# Altium schematic sheet 01-POWER.SchDoc
size A3
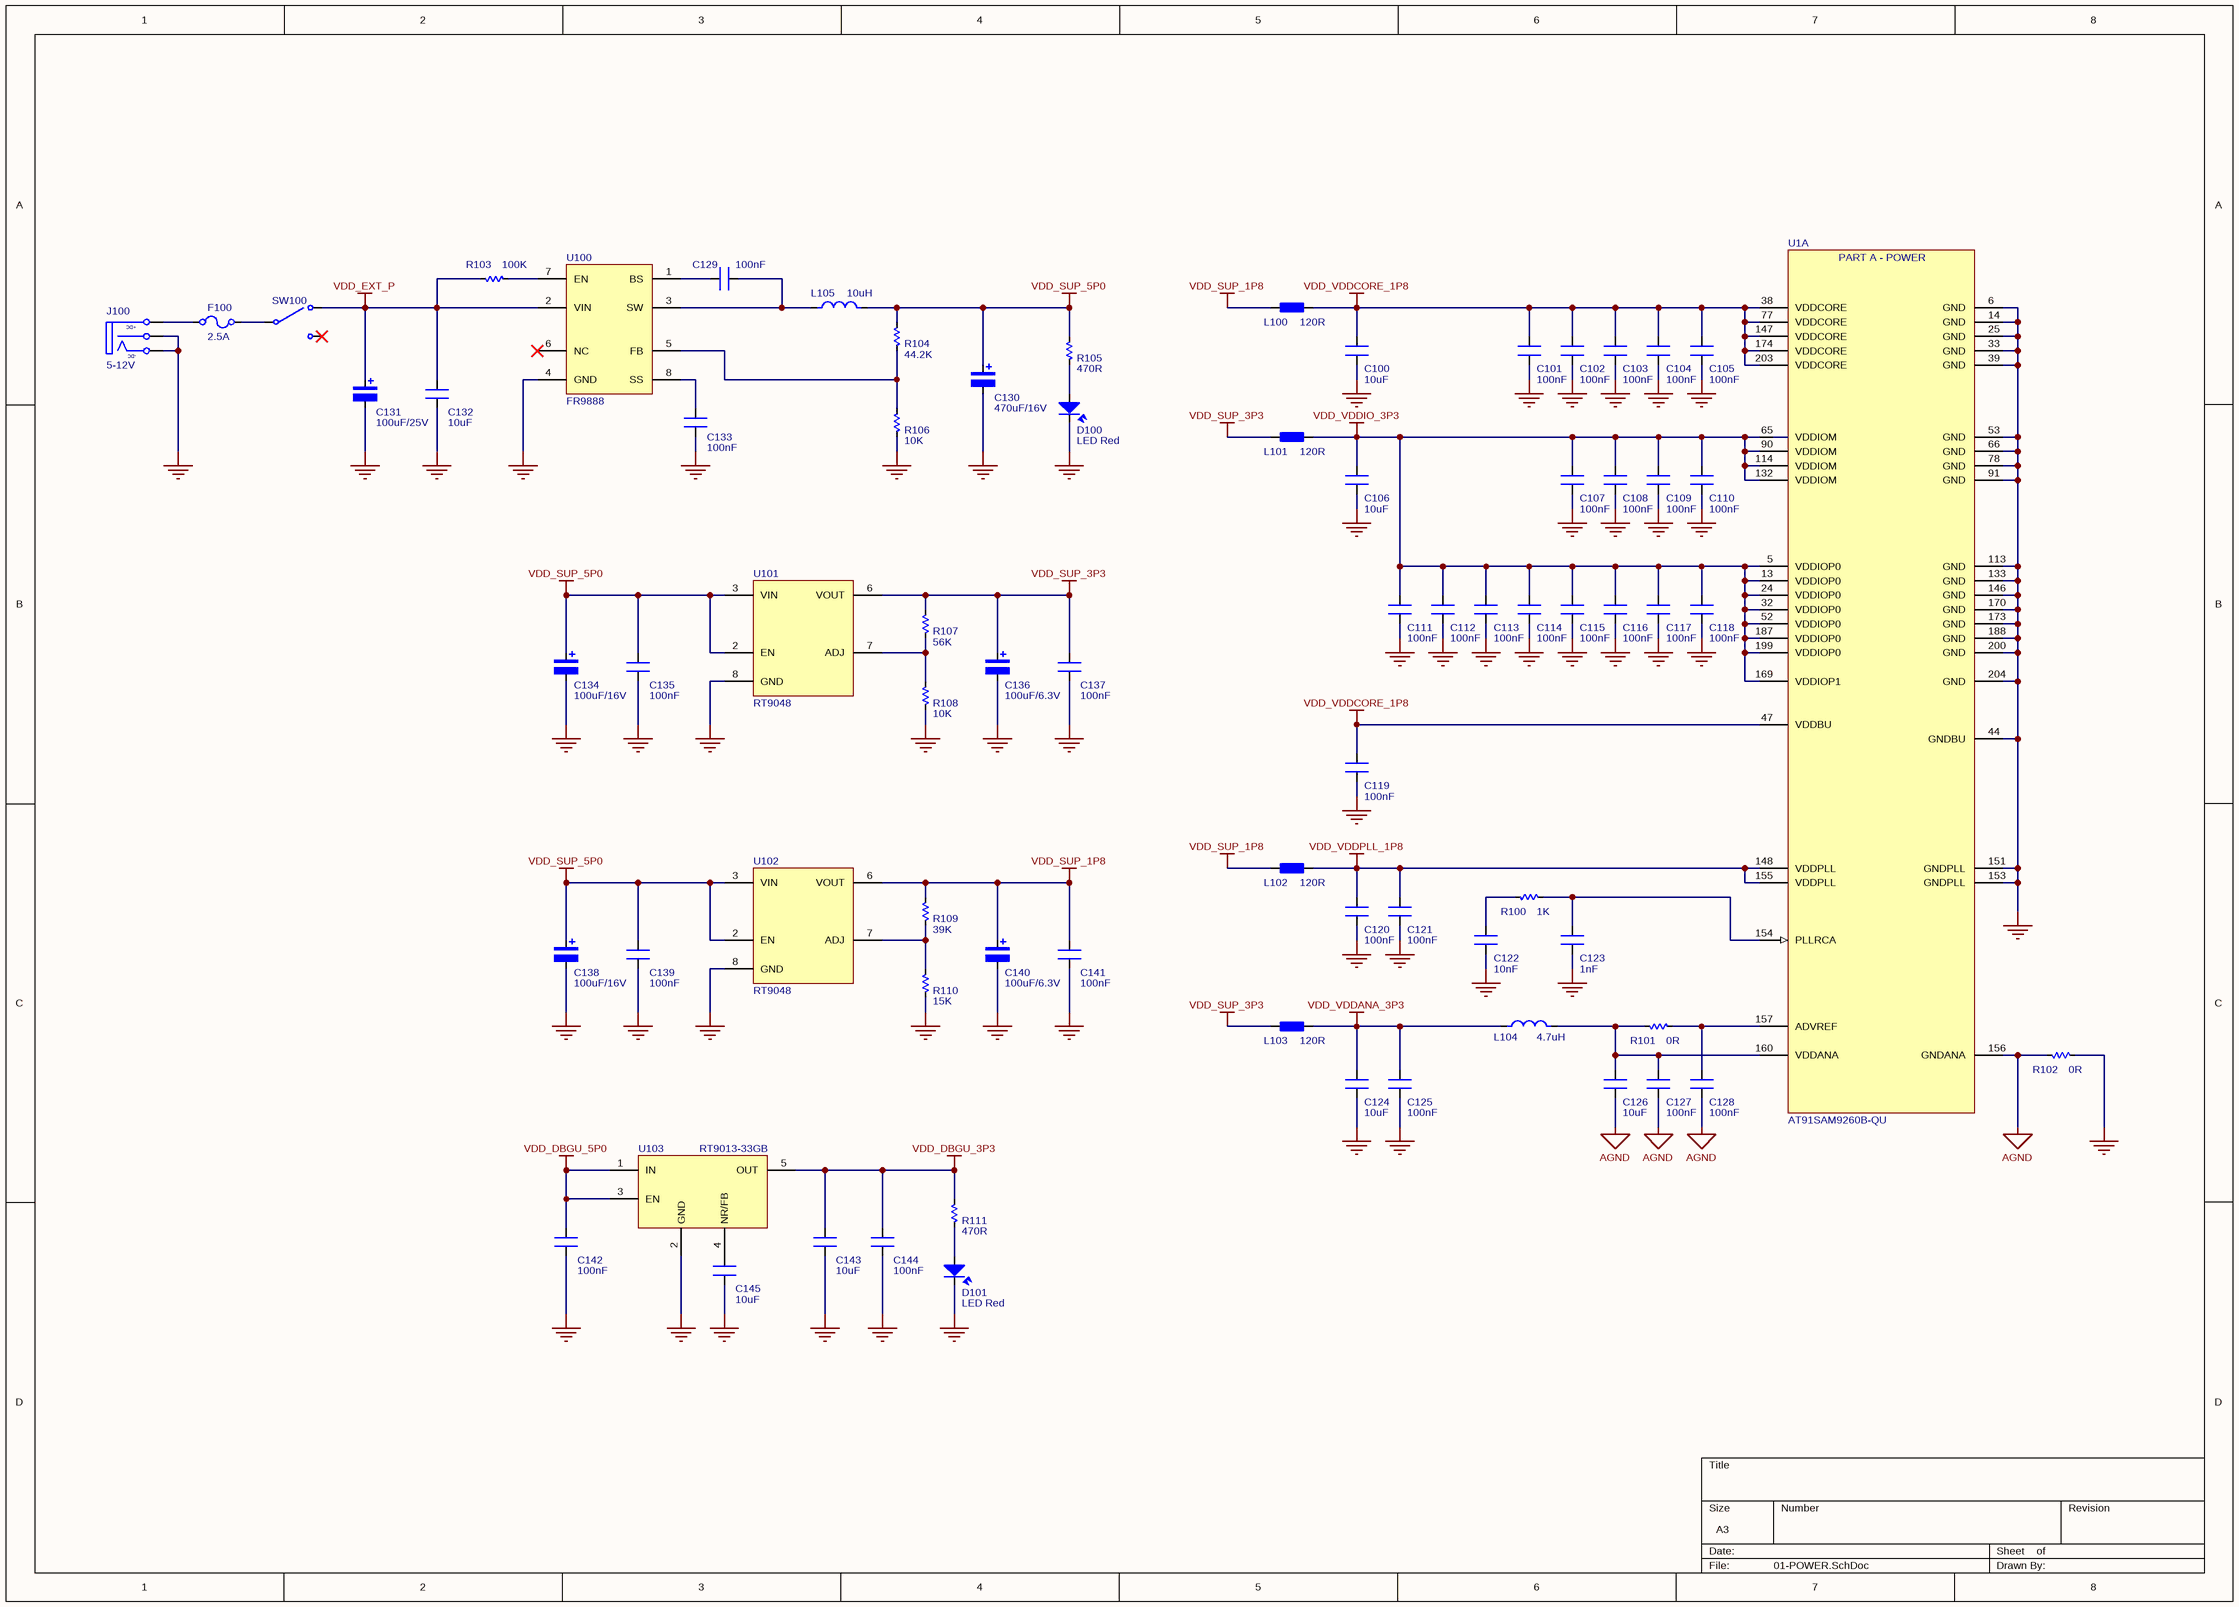
[diagram p0: 01-POWER.SchDoc]

## Parts
C100  value 10uF  [CN-SMD-0603]  (hidden comment: Capacitor)
C101  value 100nF  [CN-SMD-0603]  (hidden comment: Capacitor)
C102  value 100nF  [CN-SMD-0603]  (hidden comment: Capacitor)
C103  value 100nF  [CN-SMD-0603]  (hidden comment: Capacitor)
C104  value 100nF  [CN-SMD-0603]  (hidden comment: Capacitor)
C105  value 100nF  [CN-SMD-0603]  (hidden comment: Capacitor)
C106  value 10uF  [CN-SMD-0603]  (hidden comment: Capacitor)
C107  value 100nF  [CN-SMD-0603]  (hidden comment: Capacitor)
C108  value 100nF  [CN-SMD-0603]  (hidden comment: Capacitor)
C109  value 100nF  [CN-SMD-0603]  (hidden comment: Capacitor)
C110  value 100nF  [CN-SMD-0603]  (hidden comment: Capacitor)
C111  value 100nF  [CN-SMD-0603]  (hidden comment: Capacitor)
C112  value 100nF  [CN-SMD-0603]  (hidden comment: Capacitor)
C113  value 100nF  [CN-SMD-0603]  (hidden comment: Capacitor)
C114  value 100nF  [CN-SMD-0603]  (hidden comment: Capacitor)
C115  value 100nF  [CN-SMD-0603]  (hidden comment: Capacitor)
C116  value 100nF  [CN-SMD-0603]  (hidden comment: Capacitor)
C117  value 100nF  [CN-SMD-0603]  (hidden comment: Capacitor)
C118  value 100nF  [CN-SMD-0603]  (hidden comment: Capacitor)
C119  value 100nF  [CN-SMD-0603]  (hidden comment: Capacitor)
C120  value 100nF  [CN-SMD-0603]  (hidden comment: Capacitor)
C121  value 100nF  [CN-SMD-0603]  (hidden comment: Capacitor)
C122  value 10nF  [CN-SMD-0603]  (hidden comment: Capacitor)
C123  value 1nF  [CN-SMD-0603]  (hidden comment: Capacitor)
C124  value 10uF  [CN-SMD-0603]  (hidden comment: Capacitor)
C125  value 100nF  [CN-SMD-0603]  (hidden comment: Capacitor)
C126  value 10uF  [CN-SMD-0603]  (hidden comment: Capacitor)
C127  value 100nF  [CN-SMD-0603]  (hidden comment: Capacitor)
C128  value 100nF  [CN-SMD-0603]  (hidden comment: Capacitor)
C129  value 100nF  [CN-SMD-0603]  (hidden comment: Capacitor)
C130  value 470uF/16V  [C-ALU-SMD-D6.3W6.6L7.7]  (hidden comment: Cap_Aluminum)
C131  value 100uF/25V  [C-ALU-SMD-D6.3W6.6L7.7]  (hidden comment: Cap_Aluminum)
C132  value 10uF  [CN-SMD-0603]  (hidden comment: Capacitor)
C133  value 100nF  [CN-SMD-0603]  (hidden comment: Capacitor)
C134  value 100uF/16V  [C-TAL-SMD-7343-31]  (hidden comment: Cap_Tantalum)
C135  value 100nF  [CN-SMD-0603]  (hidden comment: Capacitor)
C136  value 100uF/6.3V  [C-TAL-SMD-3216-18]  (hidden comment: Cap_Tantalum)
C137  value 100nF  [CN-SMD-0603]  (hidden comment: Capacitor)
C138  value 100uF/16V  [C-TAL-SMD-7343-31]  (hidden comment: Cap_Tantalum)
C139  value 100nF  [CN-SMD-0603]  (hidden comment: Capacitor)
C140  value 100uF/6.3V  [C-TAL-SMD-3216-18]  (hidden comment: Cap_Tantalum)
C141  value 100nF  [CN-SMD-0603]  (hidden comment: Capacitor)
C142  value 100nF  [CN-SMD-0603]  (hidden comment: Capacitor)
C143  value 10uF  [CN-SMD-0603]  (hidden comment: Capacitor)
C144  value 100nF  [CN-SMD-0603]  (hidden comment: Capacitor)
C145  value 10uF  [CN-SMD-0603]  (hidden comment: Capacitor)
D100  LED Red  [LED-SMD-0805-RED]
D101  LED Red  [LED-SMD-0805-RED]
F100  2.5A  [FUSE-SMD-1812]
J100  5-12V  [JACK-DC_5.5x2.1]
L100  value 120R  [L-SMD-0603]  (hidden comment: Ferrite bead)
L101  value 120R  [L-SMD-0603]  (hidden comment: Ferrite bead)
L102  value 120R  [L-SMD-0603]  (hidden comment: Ferrite bead)
L103  value 120R  [L-SMD-0603]  (hidden comment: Ferrite bead)
L104  value 4.7uH  [L-SMD-0603]  (hidden comment: Inductor)
L105  value 10uH  [L-SMD-0630]  (hidden comment: Inductor)
R100  value 1K  [RES-SMD-0603]  (hidden comment: Resistor)
R101  value 0R  [RES-SMD-0603]  (hidden comment: Resistor)
R102  value 0R  [RES-SMD-0603]  (hidden comment: Resistor)
R103  value 100K  [RES-SMD-0603]  (hidden comment: Resistor)
R104  value 44.2K  [RES-SMD-0603]  (hidden comment: Resistor)
R105  value 470R  [RES-SMD-0603]  (hidden comment: Resistor)
R106  value 10K  [RES-SMD-0603]  (hidden comment: Resistor)
R107  value 56K  [RES-SMD-0603]  (hidden comment: Resistor)
R108  value 10K  [RES-SMD-0603]  (hidden comment: Resistor)
R109  value 39K  [RES-SMD-0603]  (hidden comment: Resistor)
R110  value 15K  [RES-SMD-0603]  (hidden comment: Resistor)
R111  value 470R  [RES-SMD-0603]  (hidden comment: Resistor)
SW100  SW3-SLIDE  [SW3_SS12F23]  (value not drawn)
U1  AT91SAM9260B-QU  [PQFP50P3060X3060X410-208N]  (part A of 6)
U100  FR9888  [SOIC127P600X175_HS-9N]
U101  RT9048  [SOIC127P600X175_HS-9N]
U102  RT9048  [SOIC127P600X175_HS-9N]
U103  RT9013-33GB  [SOT95P245X110-5N]

## Nets
AGND: C126.1 C127.1 C128.1 R102.2 U1.156(GNDANA)
GND: C100.1 C101.1 C102.1 C103.1 C104.1 C105.1 C106.1 C107.1 C108.1 C109.1 C110.1 C111.1 C112.1 C113.1 C114.1 C115.1 C116.1 C117.1 C118.1 C119.1 C120.1 C121.1 C122.1 C123.1 C124.1 C125.1 C130.2 C131.2 C132.1 C133.1 C134.2 C135.1 C136.2 C137.1 C138.2 C139.1 C140.2 C141.1 C142.1 C143.1 C144.1 C145.1 D100.2 D101.2 J100.2(-DC) J100.3 R102.1 R106.2 R108.2 R110.2 U1.6(GND) U1.14(GND) U1.25(GND) U1.33(GND) U1.39(GND) U1.44(GNDBU) U1.53(GND) U1.66(GND) U1.78(GND) U1.91(GND) U1.113(GND) U1.133(GND) U1.146(GND) U1.151(GNDPLL) U1.153(GNDPLL) U1.170(GND) U1.173(GND) U1.188(GND) U1.200(GND) U1.204(GND) U100.4(GND) U101.8(GND) U102.8(GND) U103.2(GND)
VDD_DBGU_3P3: C143.2 C144.2 R111.1 U103.5(OUT)
VDD_DBGU_5P0: C142.2 U103.1(IN) U103.3(EN)
VDD_EXT_P: C131.1 C132.2 R103.2 SW100.1 U100.2(VIN)
VDD_SUP_1P8: C140.1 C141.2 L100.2 L102.2 R109.1 U102.6(VOUT)
VDD_SUP_3P3: C136.1 C137.2 L101.2 L103.2 R107.1 U101.6(VOUT)
VDD_SUP_5P0: C130.1 C134.1 C135.2 C138.1 C139.2 L105.2 R104.1 R105.1 U101.2(EN) U101.3(VIN) U102.2(EN) U102.3(VIN)
VDD_VDDANA_3P3: C124.2 C125.2 L103.1 L104.2
VDD_VDDCORE_1P8: C100.2 C101.2 C102.2 C103.2 C104.2 C105.2 C119.2 L100.1 U1.38(VDDCORE) U1.47(VDDBU) U1.77(VDDCORE) U1.147(VDDCORE) U1.174(VDDCORE) U1.203(VDDCORE)
VDD_VDDIO_3P3: C106.2 C107.2 C108.2 C109.2 C110.2 C111.2 C112.2 C113.2 C114.2 C115.2 C116.2 C117.2 C118.2 L101.1 U1.5(VDDIOP0) U1.13(VDDIOP0) U1.24(VDDIOP0) U1.32(VDDIOP0) U1.52(VDDIOP0) U1.65(VDDIOM) U1.90(VDDIOM) U1.114(VDDIOM) U1.132(VDDIOM) U1.169(VDDIOP1) U1.187(VDDIOP0) U1.199(VDDIOP0)
VDD_VDDPLL_1P8: C120.2 C121.2 L102.1 U1.148(VDDPLL) U1.155(VDDPLL)
NetC122_2: C122.2 R100.2
NetC123_2: C123.2 R100.1 U1.154(PLLRCA)
NetC126_2: C126.2 C127.2 L104.1 R101.2 U1.160(VDDANA)
NetC128_2: C128.2 R101.1 U1.157(ADVREF)
NetC129_1: C129.1 L105.1 U100.3(SW)
NetC129_2: C129.2 U100.1(BS)
NetC133_2: C133.2 U100.8(SS)
NetC145_2: C145.2 U103.4(NR/FB)
NetD100_1: D100.1 R105.2
NetD101_1: D101.1 R111.2
NetF100_1: F100.1 J100.1(+DC)
NetF100_2: F100.2 SW100.2
NetR103_1: R103.1 U100.7(EN)
NetR104_2: R104.2 R106.1 U100.5(FB)
NetR107_2: R107.2 R108.1 U101.7(ADJ)
NetR109_2: R109.2 R110.1 U102.7(ADJ)

Not connected (* = marked no-connect by the designer): SW100 3*; U100 6(NC)*

## Notes on the sheet
- (in symbol AT91SAM9260B-QU, part A) PART A - POWER

## Library data of the parts
C100 C106 C124 C126 = Cap: Ceramic Capacitor SMD 0603 10uF ±20% 10V
C101-C105 C107-C121 C125 C127-C129 C133 = Cap: Ceramic Capacitor SMD 0603 100nF ±20% 10V
C122 = Cap: Ceramic Capacitor SMD 0603 10nF ±20% 10V
C123 = Cap: Ceramic Capacitor SMD 0603 1nF ±20% 10V
C130 = Cap_Aluminum: Aluminum Capacitor SMD 470uF 16V
C131 = Cap_Aluminum: Aluminum Capacitor SMD 100uF 25V
C132 C143 C145 = Cap: Ceramic Capacitor SMD 0805 10uF ±20% 25V
C134 C138 = Cap_Tantalum: Tantalum Capacitor SMD 7343 100uF ±20% 16V
C135 C137 C139 C141 C142 C144 = Cap: Ceramic Capacitor SMD 0805 100nF ±20% 25V
C136 C140 = Cap_Tantalum: Tantalum Capacitor SMD 3216 100uF ±20% 6.3V
D100 D101 = LED: Light Emitting Diode SMD 0805 red color
F100 = FUSE: Fuse SMD1812 2.5A
J100 = DC_INPUT: DC Power Jack input 5.5x2.1mm
L100-L103 = Ferrite bead: Ferrite bead SMD 0603 120 Ohm @100MHz
L104 = Inductor: Common Inductor SMD 0603 4.7uH ±20%
L105 = Inductor: Power Inductor SMD 6.6x6.6x3mm
R100 = Res: Resistor SMD 0603 1K 1% 0.1W
R101 R102 = Res: Resistor SMD 0603 0R 1% 0.1W
R103 = Res: Resistor SMD 0603 100K 1% 0.1W
R104 = Res: Resistor SMD 0603 44.2K 1% 0.1W
R105 R111 = Res: Resistor SMD 0603 470R 1% 0.1W
R106 R108 = Res: Resistor SMD 0603 10K 1% 0.1W
R107 = Res: Resistor SMD 0603 56K 1% 0.1W
R109 = Res: Resistor SMD 0603 39K 1% 0.1W
R110 = Res: Resistor SMD 0603 15K 1% 0.1W
SW100 = SW3-SLIDE: Slide Switch 3-pin
U1 = AT91SAM9260B-QU: AT91 Series 180 MHz 32 kB Flash 8 kB SRAM 32-Bit Microcontroller - PQFP-208; MF: Microchip; MP: AT91SAM9260B-QU; Package: PQFP-208 Microchip; Price: None; SnapEDA_Link: https://www.snapeda.com/parts/AT91SAM9260B-QU/Microchip/view-part/?ref=snap; Availability: Unavailable; Value: *
U100 = FR9888: 23V, 3A, 340KHz Synchronous Step-Down / DC/DC Converter
U101 U102 = RT9048: Richtek 2A, Low Input Voltage, Ultra-Low Dropout Linear Regulator with Enable
U103 = TPS73633DBVR: Cap-Free, NMOS, 500-mA Low-Dropout Regulator with Reverse Current Protection